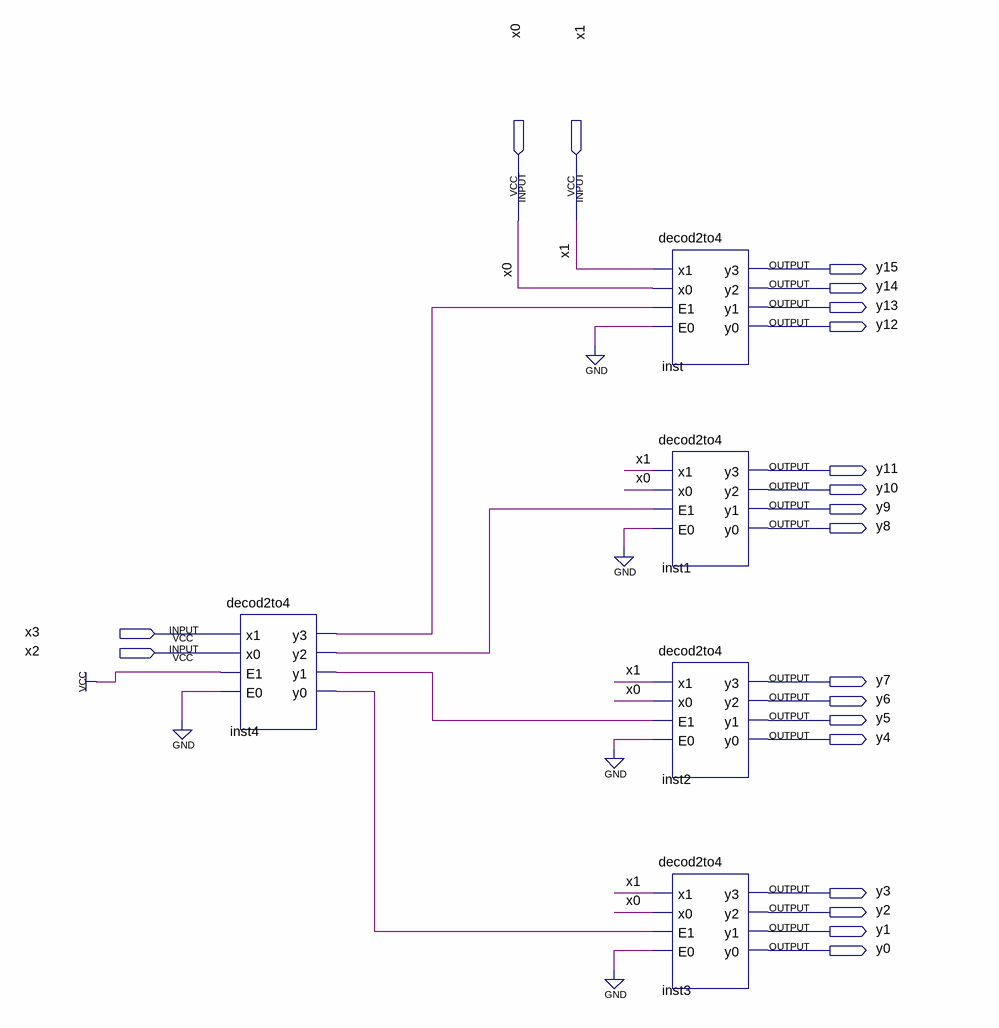
[diagram p0: schematic sheet]
// Quartus schematic decod4to16.bdf as structural Verilog: 5 symbols, 20 pins
module decod4to16 (
  input  x0,
  input  x1,
  input  x3,
  input  x2,
  output y15,
  output y14,
  output y13,
  output y12,
  output y11,
  output y10,
  output y9,
  output y8,
  output y7,
  output y6,
  output y5,
  output y4,
  output y3,
  output y2,
  output y1,
  output y0
);

  wire inst4_y0, inst4_y1, inst4_y2, inst4_y3;

  decod2to4 inst4 (.x1(x3), .x0(x2), .E1(1'b1), .E0(1'b0), .y3(inst4_y3), .y2(inst4_y2), .y1(inst4_y1), .y0(inst4_y0));
  decod2to4 inst (.x1(x1), .x0(x0), .E1(inst4_y3), .E0(1'b0), .y3(y15), .y2(y14), .y1(y13), .y0(y12));
  decod2to4 inst1 (.x1(x1), .x0(x0), .E1(inst4_y2), .E0(1'b0), .y3(y11), .y2(y10), .y1(y9), .y0(y8));
  decod2to4 inst2 (.x1(x1), .x0(x0), .E1(inst4_y1), .E0(1'b0), .y3(y7), .y2(y6), .y1(y5), .y0(y4));
  decod2to4 inst3 (.x1(x1), .x0(x0), .E1(inst4_y0), .E0(1'b0), .y3(y3), .y2(y2), .y1(y1), .y0(y0));
endmodule
